# Altium schematic sheet Top.SchDoc
size A4; SheetNumber: 1; SheetTotal: 8
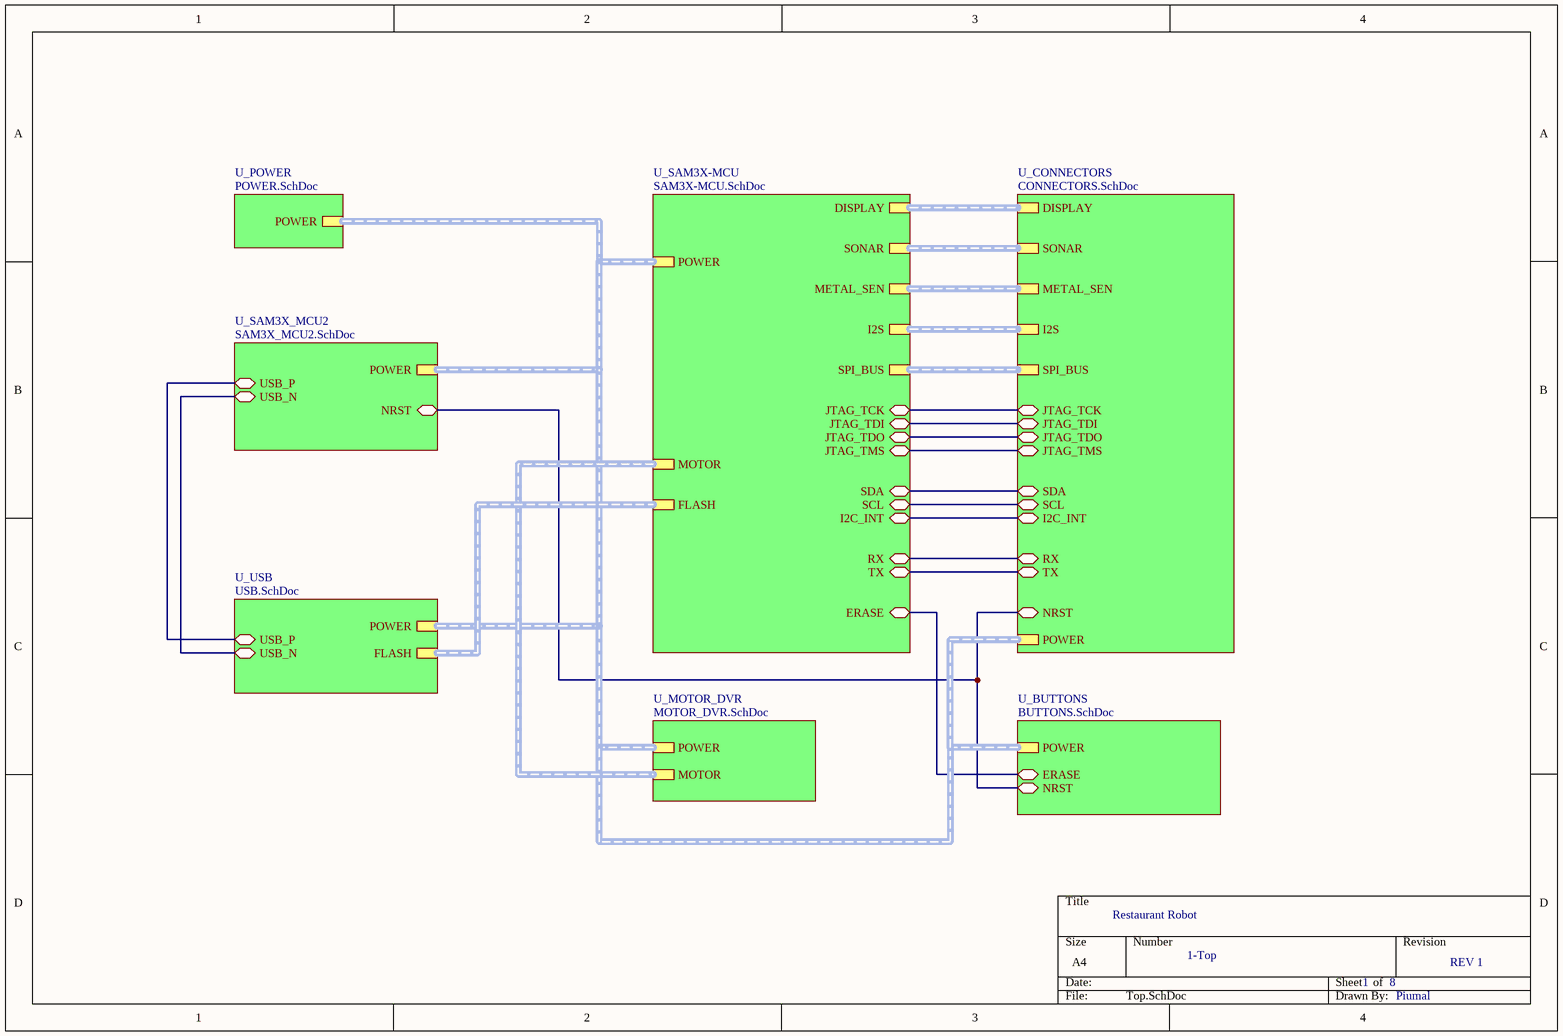
[diagram p0: Top.SchDoc]

## Sub-sheets
U_BUTTONS = BUTTONS.SchDoc: ERASE (bidir), NRST (bidir), POWER (harness POWER)
U_CONNECTORS = CONNECTORS.SchDoc: DISPLAY (harness DISPLAY), SONAR (harness SONAR), METAL_SEN (harness METAL_SEN), I2S (harness I2S), JTAG_TCK (bidir), JTAG_TDI (bidir), JTAG_TDO (bidir), JTAG_TMS (bidir), RX (bidir), TX (bidir), SDA (bidir), SCL (bidir), I2C_INT (bidir), NRST (bidir), SPI_BUS (harness SPI_BUS), POWER (harness POWER)
U_MOTOR_DVR = MOTOR_DVR.SchDoc: MOTOR (harness MOTOR), POWER (harness POWER)
U_POWER = POWER.SchDoc: POWER (harness POWER)
U_SAM3X-MCU = SAM3X-MCU.SchDoc: MOTOR (harness MOTOR), FLASH (harness FLASH), SONAR (harness SONAR), I2S (harness I2S), METAL_SEN (harness METAL_SEN), DISPLAY (harness DISPLAY), JTAG_TCK (bidir), JTAG_TDI (bidir), JTAG_TDO (bidir), JTAG_TMS (bidir), RX (bidir), TX (bidir), ERASE (bidir), SDA (bidir), SCL (bidir), I2C_INT (bidir), SPI_BUS (harness SPI_BUS), POWER (harness POWER)
U_SAM3X_MCU2 = SAM3X_MCU2.SchDoc: USB_P (bidir), USB_N (bidir), NRST (bidir), POWER (harness POWER)
U_USB = USB.SchDoc: USB_P (bidir), USB_N (bidir), FLASH (harness FLASH), POWER (harness POWER)

## Nets
(unnamed): sheet U_SAM3X-MCU/JTAG_TCK, sheet U_CONNECTORS/JTAG_TCK
(unnamed): sheet U_SAM3X-MCU/JTAG_TDI, sheet U_CONNECTORS/JTAG_TDI
(unnamed): sheet U_SAM3X-MCU/JTAG_TDO, sheet U_CONNECTORS/JTAG_TDO
(unnamed): sheet U_SAM3X-MCU/JTAG_TMS, sheet U_CONNECTORS/JTAG_TMS
(unnamed): sheet U_SAM3X-MCU/RX, sheet U_CONNECTORS/RX
(unnamed): sheet U_SAM3X-MCU/TX, sheet U_CONNECTORS/TX
(unnamed): sheet U_SAM3X-MCU/ERASE, sheet U_BUTTONS/ERASE
(unnamed): sheet U_SAM3X-MCU/SDA, sheet U_CONNECTORS/SDA
(unnamed): sheet U_SAM3X-MCU/SCL, sheet U_CONNECTORS/SCL
(unnamed): sheet U_SAM3X-MCU/I2C_INT, sheet U_CONNECTORS/I2C_INT
(unnamed): sheet U_SAM3X_MCU2/USB_P, sheet U_USB/USB_P
(unnamed): sheet U_SAM3X_MCU2/USB_N, sheet U_USB/USB_N
(unnamed): sheet U_SAM3X_MCU2/NRST, sheet U_BUTTONS/NRST, sheet U_CONNECTORS/NRST

## Buses and harness runs
harness sheet U_BUTTONS/POWER = sheet U_CONNECTORS/POWER = sheet U_MOTOR_DVR/POWER = sheet U_POWER/POWER = sheet U_SAM3X-MCU/POWER = sheet U_SAM3X_MCU2/POWER = sheet U_USB/POWER
harness sheet U_CONNECTORS/DISPLAY = sheet U_SAM3X-MCU/DISPLAY
harness sheet U_CONNECTORS/I2S = sheet U_SAM3X-MCU/I2S
harness sheet U_CONNECTORS/METAL_SEN = sheet U_SAM3X-MCU/METAL_SEN
harness sheet U_CONNECTORS/SONAR = sheet U_SAM3X-MCU/SONAR
harness sheet U_CONNECTORS/SPI_BUS = sheet U_SAM3X-MCU/SPI_BUS
harness sheet U_MOTOR_DVR/MOTOR = sheet U_SAM3X-MCU/MOTOR
harness sheet U_SAM3X-MCU/FLASH = sheet U_USB/FLASH

## Notes on the sheet
- Restaurant Robot
- 1-Top
- 1
- 8
- REV 1
- Piumal